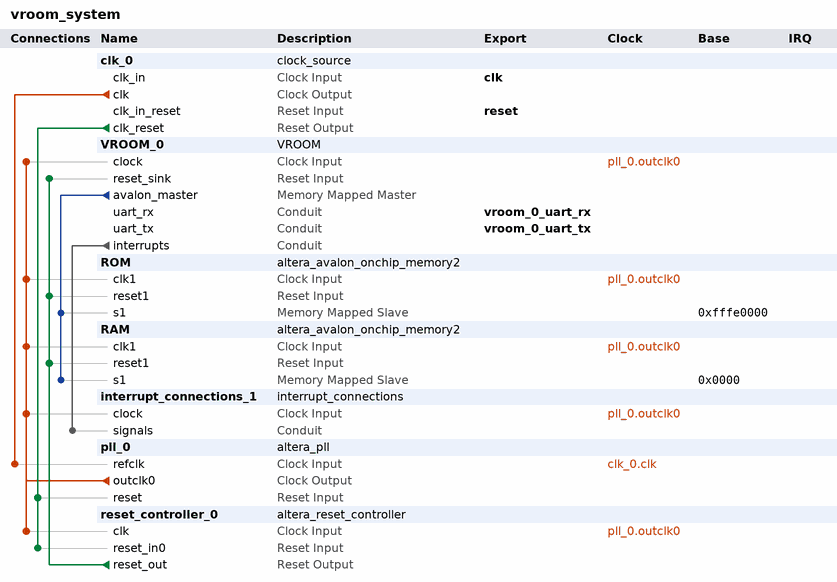
[diagram p0: system contents]
# Platform Designer (Qsys) system vroom_system, Stratix V 5SGSMD5K1F40C1
# Parameters at their usual value, and those the tool derives, are not listed.
package require -exact qsys 23.1
create_system vroom_system
set_project_property DEVICE_FAMILY {Stratix V}
set_project_property DEVICE 5SGSMD5K1F40C1

add_instance clk_0 clock_source 23.1
set_instance_parameter_value clk_0 clockFrequency 125000000

add_instance VROOM_0 VROOM 1.0
set_instance_parameter_value VROOM_0 SIMULATION false

add_instance ROM altera_avalon_onchip_memory2 23.1
set_instance_parameter_value ROM dataWidth 32
set_instance_parameter_value ROM dualPort false
set_instance_parameter_value ROM initMemContent true
set_instance_parameter_value ROM initializationFileName /home/julien/work/VROOM/fpga/proj/storeypeak/rom.mif
set_instance_parameter_value ROM memorySize 131072
set_instance_parameter_value ROM useNonDefaultInitFile true
set_instance_parameter_value ROM writable false

add_instance RAM altera_avalon_onchip_memory2 23.1
set_instance_parameter_value RAM dataWidth 32
set_instance_parameter_value RAM dualPort false
set_instance_parameter_value RAM initMemContent false
set_instance_parameter_value RAM initializationFileName onchip_mem.hex
set_instance_parameter_value RAM memorySize 32768

add_instance interrupt_connections_1 interrupt_connections 1.0

add_instance pll_0 altera_pll 23.1
set_instance_parameter_value pll_0 gui_device_speed_grade 1
set_instance_parameter_value pll_0 gui_number_of_clocks 1
set_instance_parameter_value pll_0 gui_operation_mode direct
set_instance_parameter_value pll_0 gui_output_clock_frequency0 50.0
set_instance_parameter_value pll_0 gui_pll_mode {Integer-N PLL}
set_instance_parameter_value pll_0 gui_reference_clock_frequency 125.0
set_instance_parameter_value pll_0 gui_use_locked false

add_instance reset_controller_0 altera_reset_controller 23.1
set_instance_parameter_value reset_controller_0 NUM_RESET_INPUTS 1
set_instance_parameter_value reset_controller_0 SYNC_DEPTH 2

# connections
add_connection clk_0.clk pll_0.refclk clock
add_connection pll_0.outclk0 interrupt_connections_1.clock clock
add_connection pll_0.outclk0 RAM.clk1 clock
add_connection pll_0.outclk0 reset_controller_0.clk clock
add_connection pll_0.outclk0 ROM.clk1 clock
add_connection pll_0.outclk0 VROOM_0.clock clock
add_connection clk_0.clk_reset pll_0.reset reset
add_connection clk_0.clk_reset reset_controller_0.reset_in0 reset
add_connection reset_controller_0.reset_out RAM.reset1 reset
add_connection reset_controller_0.reset_out ROM.reset1 reset
add_connection reset_controller_0.reset_out VROOM_0.reset_sink reset
add_connection VROOM_0.avalon_master RAM.s1 avalon
set_connection_parameter_value VROOM_0.avalon_master/RAM.s1 baseAddress 0x0000
add_connection VROOM_0.avalon_master ROM.s1 avalon
set_connection_parameter_value VROOM_0.avalon_master/ROM.s1 baseAddress 0xfffe0000
add_connection VROOM_0.interrupts interrupt_connections_1.signals conduit

# exported interfaces
add_interface clk clock sink
set_interface_property clk EXPORT_OF clk_0.clk_in
add_interface reset reset sink
set_interface_property reset EXPORT_OF clk_0.clk_in_reset
add_interface vroom_0_uart_rx conduit end
set_interface_property vroom_0_uart_rx EXPORT_OF VROOM_0.uart_rx
add_interface vroom_0_uart_tx conduit end
set_interface_property vroom_0_uart_tx EXPORT_OF VROOM_0.uart_tx

set_interconnect_requirement {$system} qsys_mm.clockCrossingAdapter HANDSHAKE
set_interconnect_requirement {$system} qsys_mm.enableEccProtection FALSE
set_interconnect_requirement {$system} qsys_mm.insertDefaultSlave FALSE
set_interconnect_requirement {$system} qsys_mm.maxAdditionalLatency 1

save_system vroom_system.qsys
